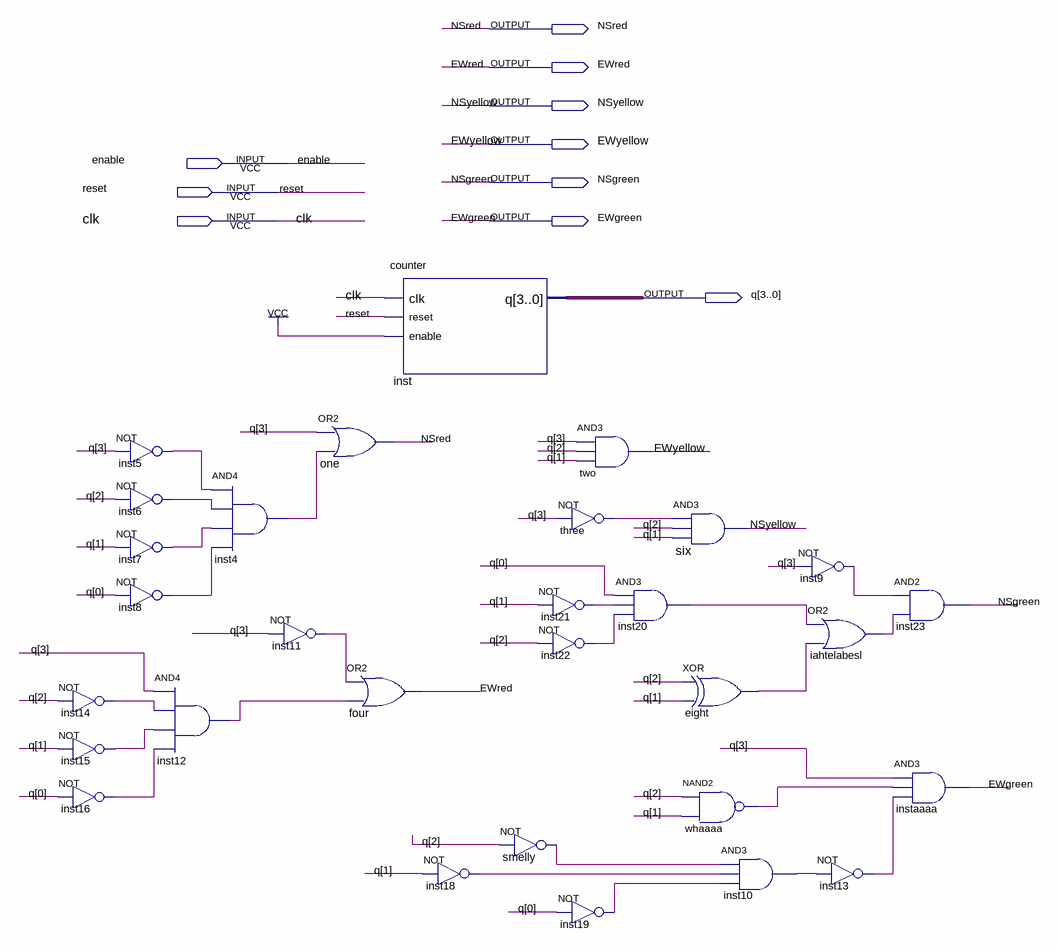
[diagram p0: schematic sheet]
// Quartus schematic traffic.bdf as structural Verilog: 30 symbols, 10 pins
module traffic (
  input  enable,
  input  reset,
  input  clk,
  output NSred,
  output EWred,
  output NSyellow,
  output EWyellow,
  output NSgreen,
  output EWgreen,
  output [3:0] q
);

  wire eight_out, iahtelabesl_out, inst4_out, inst5_out, inst6_out, inst7_out, inst8_out, inst9_out,
       inst10_out, inst11_out, inst12_out, inst13_out, inst14_out, inst15_out, inst16_out, inst18_out,
       inst19_out, inst20_out, inst21_out, inst22_out, smelly_out, three_out, whaaaa_out;

  not inst14 (inst14_out, q[2]);
  not inst15 (inst15_out, q[1]);
  not inst16 (inst16_out, q[0]);
  not inst5 (inst5_out, q[3]);
  not inst6 (inst6_out, q[2]);
  not inst7 (inst7_out, q[1]);
  not inst8 (inst8_out, q[0]);
  and inst12 (inst12_out, q[3], inst14_out, inst15_out, inst16_out);
  and inst4 (inst4_out, inst5_out, inst6_out, inst7_out, inst8_out);
  or one (NSred, q[3], inst4_out);
  not inst11 (inst11_out, q[3]);
  counter inst (.clk(clk), .reset(reset), .enable(1'b1), .q(q));
  or four (EWred, inst11_out, inst12_out);
  not inst18 (inst18_out, q[1]);
  not three (three_out, q[3]);
  not inst21 (inst21_out, q[1]);
  not inst22 (inst22_out, q[2]);
  not smelly (smelly_out, q[2]);
  not inst19 (inst19_out, q[0]);
  and two (EWyellow, q[3], q[2], q[1]);
  and inst20 (inst20_out, q[0], inst21_out, inst22_out);
  and six (NSyellow, three_out, q[2], q[1]);
  xor eight (eight_out, q[2], q[1]);
  nand whaaaa (whaaaa_out, q[2], q[1]);
  and inst10 (inst10_out, smelly_out, inst18_out, inst19_out);
  not inst9 (inst9_out, q[3]);
  or iahtelabesl (iahtelabesl_out, inst20_out, eight_out);
  not inst13 (inst13_out, inst10_out);
  and inst23 (NSgreen, inst9_out, iahtelabesl_out);
  and instaaaa (EWgreen, q[3], whaaaa_out, inst13_out);
endmodule
